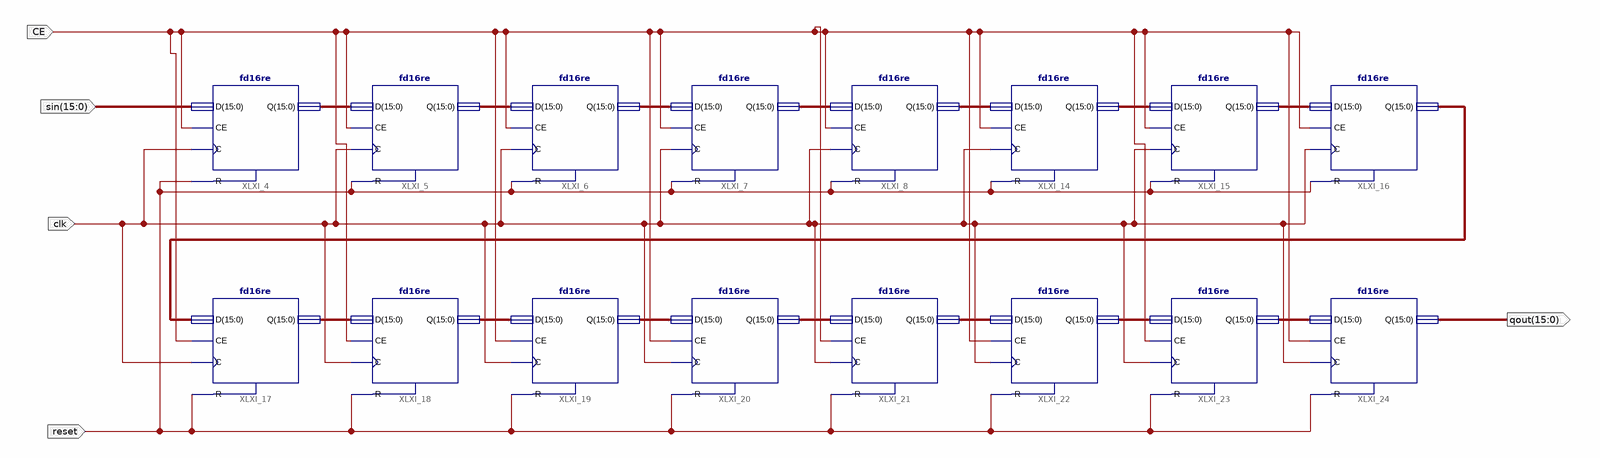
[diagram p0: schematic sheet 1]
// Xilinx ISE schematic counter16bit.sch (spartan3e) as structural Verilog: 16 symbols, 5 ports
module counter16bit (
  input  reset,
  input  [15:0] sin,
  input  clk,
  input  CE,
  output [15:0] qout
);

  wire [15:0] XLXN_19, XLXN_23, XLXN_24, XLXN_25, XLXN_26, XLXN_27, XLXN_28, XLXN_29, XLXN_30, XLXN_32,
       XLXN_33, XLXN_34, XLXN_35, XLXN_36, XLXN_37;

  fd16re XLXI_4 (.C(clk), .CE(CE), .D(sin), .R(reset), .Q(XLXN_23));
  fd16re XLXI_5 (.C(clk), .CE(CE), .D(XLXN_23), .R(reset), .Q(XLXN_24));
  fd16re XLXI_6 (.C(clk), .CE(CE), .D(XLXN_24), .R(reset), .Q(XLXN_25));
  fd16re XLXI_7 (.C(clk), .CE(CE), .D(XLXN_25), .R(reset), .Q(XLXN_26));
  fd16re XLXI_8 (.C(clk), .CE(CE), .D(XLXN_26), .R(reset), .Q(XLXN_27));
  fd16re XLXI_14 (.C(clk), .CE(CE), .D(XLXN_27), .R(reset), .Q(XLXN_28));
  fd16re XLXI_15 (.C(clk), .CE(CE), .D(XLXN_28), .R(reset), .Q(XLXN_29));
  fd16re XLXI_16 (.C(clk), .CE(CE), .D(XLXN_29), .R(reset), .Q(XLXN_19));
  fd16re XLXI_17 (.C(clk), .CE(CE), .D(XLXN_19), .R(reset), .Q(XLXN_37));
  fd16re XLXI_18 (.C(clk), .CE(CE), .D(XLXN_37), .R(reset), .Q(XLXN_36));
  fd16re XLXI_19 (.C(clk), .CE(CE), .D(XLXN_36), .R(reset), .Q(XLXN_35));
  fd16re XLXI_20 (.C(clk), .CE(CE), .D(XLXN_35), .R(reset), .Q(XLXN_34));
  fd16re XLXI_21 (.C(clk), .CE(CE), .D(XLXN_34), .R(reset), .Q(XLXN_33));
  fd16re XLXI_22 (.C(clk), .CE(CE), .D(XLXN_33), .R(reset), .Q(XLXN_32));
  fd16re XLXI_23 (.C(clk), .CE(CE), .D(XLXN_32), .R(reset), .Q(XLXN_30));
  fd16re XLXI_24 (.C(clk), .CE(CE), .D(XLXN_30), .R(reset), .Q(qout));
endmodule
